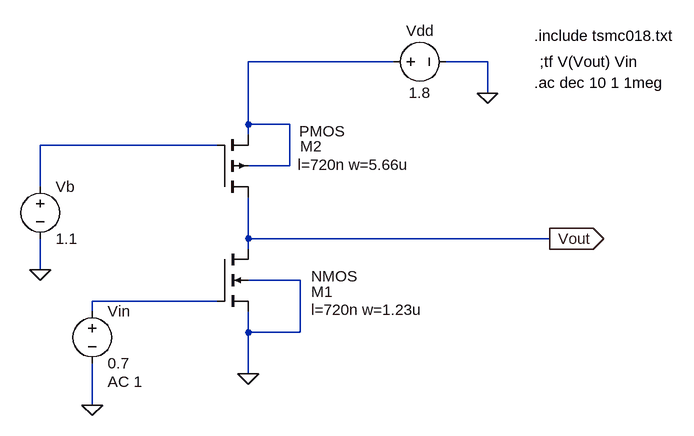
[diagram p0: schematic CS Amplifier(Gain=50).asc]
CS Amplifier(Gain=50).asc, the LTspice schematic file:
Version 4
SHEET 1 928 680
WIRE 464 -128 240 -128
WIRE 608 -128 544 -128
WIRE 608 -80 608 -128
WIRE 240 -32 240 -128
WIRE 304 -32 240 -32
WIRE 240 -16 240 -32
WIRE 192 0 -80 0
WIRE 304 32 304 -32
WIRE 304 32 240 32
WIRE -80 64 -80 0
WIRE 240 144 240 80
WIRE 704 144 240 144
WIRE 240 160 240 144
WIRE -80 192 -80 144
WIRE 320 208 240 208
WIRE 192 240 0 240
WIRE 0 256 0 240
WIRE 240 288 240 256
WIRE 320 288 320 208
WIRE 320 288 240 288
WIRE 240 352 240 288
WIRE 0 400 0 336
FLAG 608 -80 0
FLAG 240 352 0
FLAG 0 400 0
FLAG -80 192 0
FLAG 704 144 Vout
IOPIN 704 144 Out
SYMBOL nmos4 192 160 R0
WINDOW 123 145 93 Left 2
WINDOW 0 145 66 Left 2
WINDOW 3 145 42 Left 2
SYMATTR Value2 l=720n w=1.23u
SYMATTR InstName M1
SYMBOL voltage 448 -128 R270
WINDOW 0 32 56 VTop 2
WINDOW 3 -32 56 VBottom 2
SYMATTR InstName Vdd
SYMATTR Value 1.8
SYMBOL voltage 0 240 R0
WINDOW 123 24 124 Left 2
WINDOW 39 0 0 Left 0
SYMATTR Value2 AC 1
SYMATTR InstName Vin
SYMATTR Value 0.7
SYMBOL voltage -80 48 R0
WINDOW 123 0 0 Left 0
WINDOW 39 0 0 Left 0
SYMATTR InstName Vb
SYMATTR Value 1.1
SYMBOL pmos4 192 80 M180
WINDOW 123 124 50 Left 2
WINDOW 0 128 78 Left 2
WINDOW 3 126 101 Left 2
SYMATTR Value2 l=720n w=5.66u
SYMATTR InstName M2
TEXT 680 -168 Left 2 !.include tsmc018.txt
TEXT 688 -128 Left 2 !;tf V(Vout) Vin
TEXT 680 -96 Left 2 !.ac dec 10 1 1meg

The netlist it stands for:
* CS Amplifier(Gain=50).asc
M1 Vout N003 0 0 NMOS l=720n w=1.23u
Vdd N001 0 1.8
Vin N003 0 0.7 AC 1
Vb N002 0 1.1
M2 Vout N002 N001 N001 PMOS l=720n w=5.66u
.model NMOS NMOS
.model PMOS PMOS
.lib standard.mos
.include tsmc018.txt
;tf V(Vout) Vin
.ac dec 10 1 1meg
.backanno
.end